# Altium project delta-pcb.PrjPcb
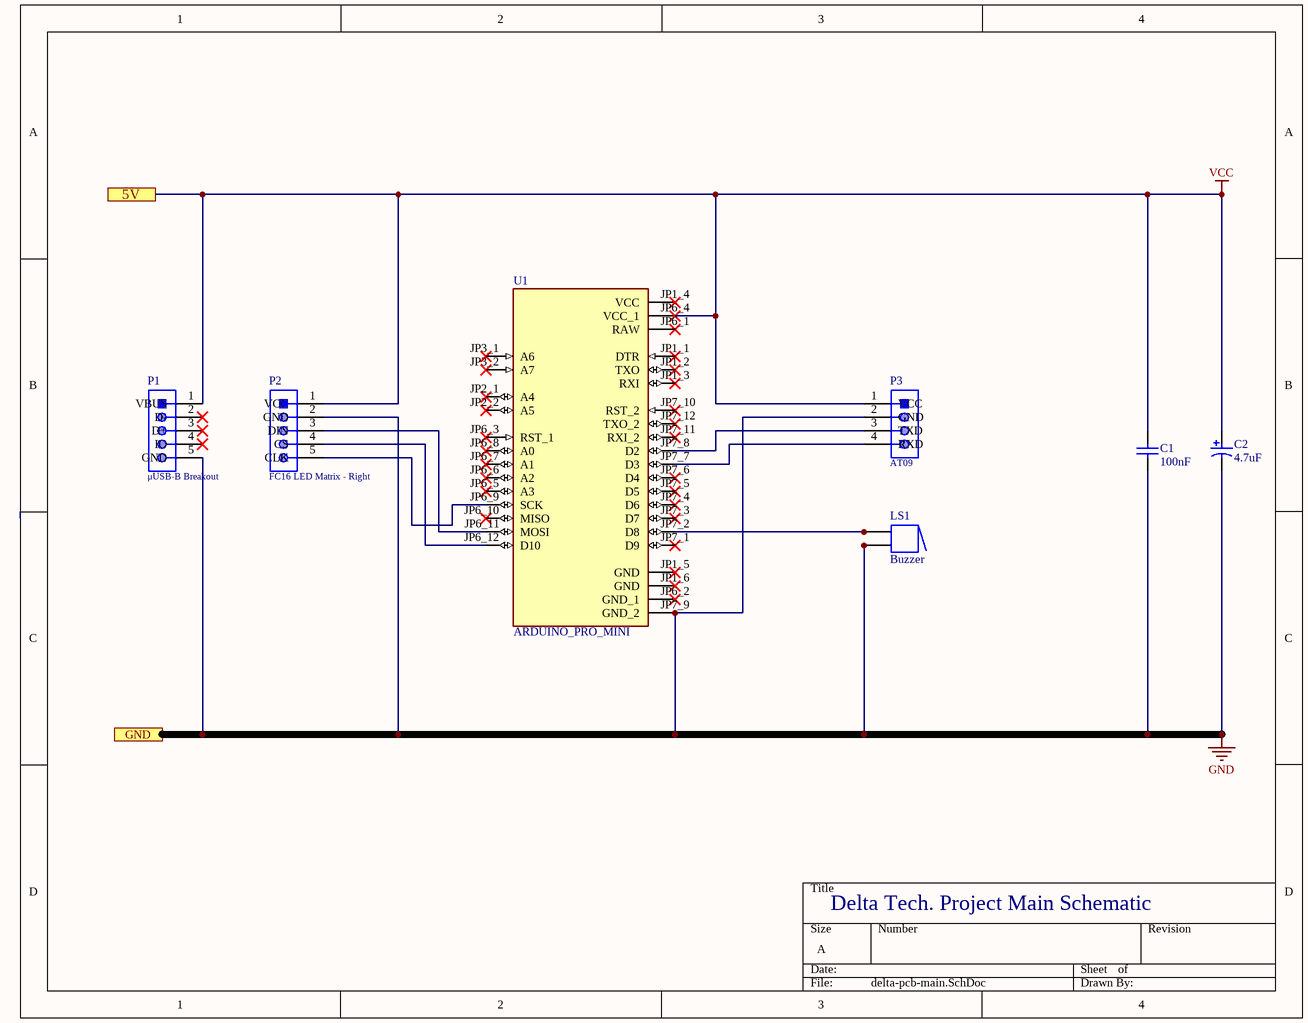
[diagram p0: delta-pcb-main.SchDoc]
1 sheet, 7 parts. Net scope: flat (ports and power ports of the same name join across sheets).
Board file: delta-pcb.PcbDoc

## Sheet delta-pcb-main.SchDoc
size A; SheetNumber: 1; SheetTotal: 1

### Parts
C1  100nF  [VISH-K104K15X7RF5TL2]
C2  4.7uF  [CAPPR55-200-1100X500X1200]
LS1  Buzzer  [ABSM-1574]
P1  μUSB-B Breakout  [61300511121]
P2  FC16 LED Matrix - Right  [61300511121]
P3  AT09  [61300411121]
U1  ARDUINO_PRO_MINI  [MODULE_ARDUINO_PRO_MINI]

### Ports
5V, GND

### Nets
GND: C1.1 C2.2 LS1.2 LS1.2A P1.5(GND) P2.2(GND) P3.2(GND) U1.JP7_9(GND_2) ; port GND
VCC: C1.2 C2.1 P1.1(VBUS) P2.1(VCC) P3.1(VCC) U1.JP6_4(VCC_1) ; port 5V
NetLS1_1: LS1.1 LS1.1A U1.JP7_2(D8)
NetP2_3: P2.3(DIN) U1.JP6_11(MOSI)
NetP2_4: P2.4(CS) U1.JP6_12(D10)
NetP2_5: P2.5(CLK) U1.JP6_9(SCK)
NetP3_3: P3.3(TXD) U1.JP7_8(D2)
NetP3_4: P3.4(RXD) U1.JP7_7(D3)

Not connected (* = marked no-connect by the designer): P1 2(D-)* 3(D+)* 4(IO)*; U1 JP1_1(DTR)* JP1_2(TXO)* JP1_3(RXI)* JP1_4(VCC)* JP1_5(GND)* JP1_6(GND)* JP2_1(A4)* JP2_2(A5)* JP3_1(A6)* JP3_2(A7)* JP6_1(RAW)* JP6_2(GND_1)* JP6_3(RST_1)* JP6_5(A3)* JP6_6(A2)* JP6_7(A1)* JP6_8(A0)* JP6_10(MISO)* JP7_1(D9)* JP7_3(D7)* JP7_4(D6)* JP7_5(D5)* JP7_6(D4)* JP7_10(RST_2)* JP7_11(RXI_2)* JP7_12(TXO_2)*

### Notes on the sheet
- Delta Tech. Project Main Schematic

### Library data of the parts
C1 = CMP-2000-06508-1: Ceramic Capacitor, 100 nF, +/- 10%, 50 V, -55 to 125 degC, 2-Pin THD, RoHS, Tape and Reel; Manufacturer: Vishay; Other Names: BC1084CT; Catalog Drawings: Mono-KapSide2-15_5.58Mono-KapSide1_15; Temperature Coefficient: X7R; Voltage - Rated: 50V; Online Catalog: Mono-Kap™Series; Capacitance: 0.1µF; Size / Dimension: 0.157"Lx0.098"W(4.00mmx2.50mm); Operating Temperature: -55°C~125°C; Family: CeramicCapacitors; Manufacturer URL: http://www.vishay.com/; Standard Package: 1; Thickness (Max): -; Ratings: -; Datasheet Version: 08/2013; Package Description: 2-Pin Through Hole Device, Body 4 x 2.6 mm; Mounting Type: ThroughHole; Features: -; Lead Spacing: 0.098"(2.50mm); Tolerance: ±10%; Category: Capacitors; Mounting Technology: ThroughHole; Lead Style: Straight; Datasheet URL: http://www.vishay.com/docs/45171/kseries.pdf; Applications: GeneralPurpose; Package / Case: Radial; Height - Seated (Max): 0.220"(5.58mm); Package Reference: K104K15X7RF5TL2; Series: Mono-Kap™K; Packaging: CutTape(CT)
C2 = CMP-1665-00037-2: Aluminum Electrolytic Capacitor, 4.7 uF, +/- 20%, 50 V, -40 to 85 degC, 2-Pin THD, RoHS, Bulk; Manufacturer: Panasonic; Life (Hours): 2000Hour; Dielectric Material: Aluminium; Voltage Rating: 50V; Leakage Current: 3uA; Ripple Current: 45mA; Lead/Base Style: Straight; Dissipation Factor: 0.12%; Lead Diameter: 0.5mm; Package Description: 2-Pin Radial Lead, Dia 5 mm, Height 12 mm; REACH SVHC: NoSVHC; RoHSCompliant: true; Height: 11mm; Package Reference: CAPPR55-200-1100X500X1200; Datasheet URL: https://industrial.panasonic.com/cdbs/www-data/pdf/RDF0000/ABA0000C1218.pdf; Lead Pitch: 2mm; Diameter: 5mm; Voltage Rating (DC): 50V; Voltage: 50V; Termination: Radial; Min Operating Temperature: -40degC; Package Quantity: 200; Max Operating Temperature: 85degC; Length: 11mm; Mount: ThroughHole; Number of Pins: 2; Lead Free: LeadFree; Ripple Current (AC): 45mA; Datasheet Version: Rev. 05, 10/2016; Width: 0inch; Capacitance: 4.7uF; Case/Package: Radial; Tolerance: 20%; Manufacturer URL: http://www.panasonic.com/; Height - Seated (Max): 0.472inch; Packaging: Bulk; Radiation Hardening: No
LS1 = Buzzer: Magnetic Transducer Buzzer; Published: 24-Mar-1999; LatestRevisionDate: 17-Dec-2003; LatestRevisionNote: Schematic revised, PCB Footprint replaced.; DatasheetVersion: 17-Dec-2003; PackageReference: ABSM-1574; Publisher: Altium Limited; PackageDescription: Magnetic Transducer Buzzer; ComponentLink1Description: Manufacturer Link; ComponentLink1URL: http://www.megastar.com/linecard/buzzmode/index.php
P1 P2 = CMP-1502-01068-1: THT Vertical Pin Header WR-PHD, Pitch 2.54 mm, Single Row, 5 pins; Manufacturer: Wurth Elektronik; Pin Number: 5; Contact Resistance: 20mOhm; Working Voltage: 250VAC; Pitch: 2.54mm; Withstanding Voltage: 500VAC; Rated Current: 3A; Gender: Male; Datasheet URL: https://katalog.we-online.de/em/datasheet/6130xx11121.pdf; Orientation: Vertical; Mounting Technology: THT; Row Number: Single; Package Reference: 61300511121; Publisher: WurthElektronik; Part Number: 61300511121; Packaging: Bag; Manufacturer URL: http://www.we-online.de; Operating Temperature: -40to105degC
P3 = CMP-1502-01064-1: THT Vertical Pin Header WR-PHD, Pitch 2.54 mm, Single Row, 4 pins; Manufacturer: Wurth Elektronik; Withstanding Voltage: 500VAC; Rated Current: 3A; Working Voltage: 250VAC; Pin Number: 4; Gender: Male; Contact Resistance: 20mOhm; Pitch: 2.54mm; Manufacturer URL: http://www.we-online.de; Operating Temperature: -40to105degC; Packaging: Bag; Mounting Technology: THT; Package Reference: 61300411121; Datasheet URL: https://katalog.we-online.de/em/datasheet/6130xx11121.pdf; Publisher: WurthElektronik; Part Number: 61300411121; Row Number: Single; Orientation: Vertical
U1 = ARDUINO_PRO_MINI: ATmega328 Arduino Pro Mini 328 5V/16MHz AVRÂ® ATmega AVR MCU 8-Bit Embedded Evaluation Board; MF: {'manufacturer': u'Arduino'}; Package: None; MP: ARDUINO_PRO_MINI; Price: None; Availability: Unavailable; Value: *